# EAGLE design acceso (EAGLE 7.1.0)
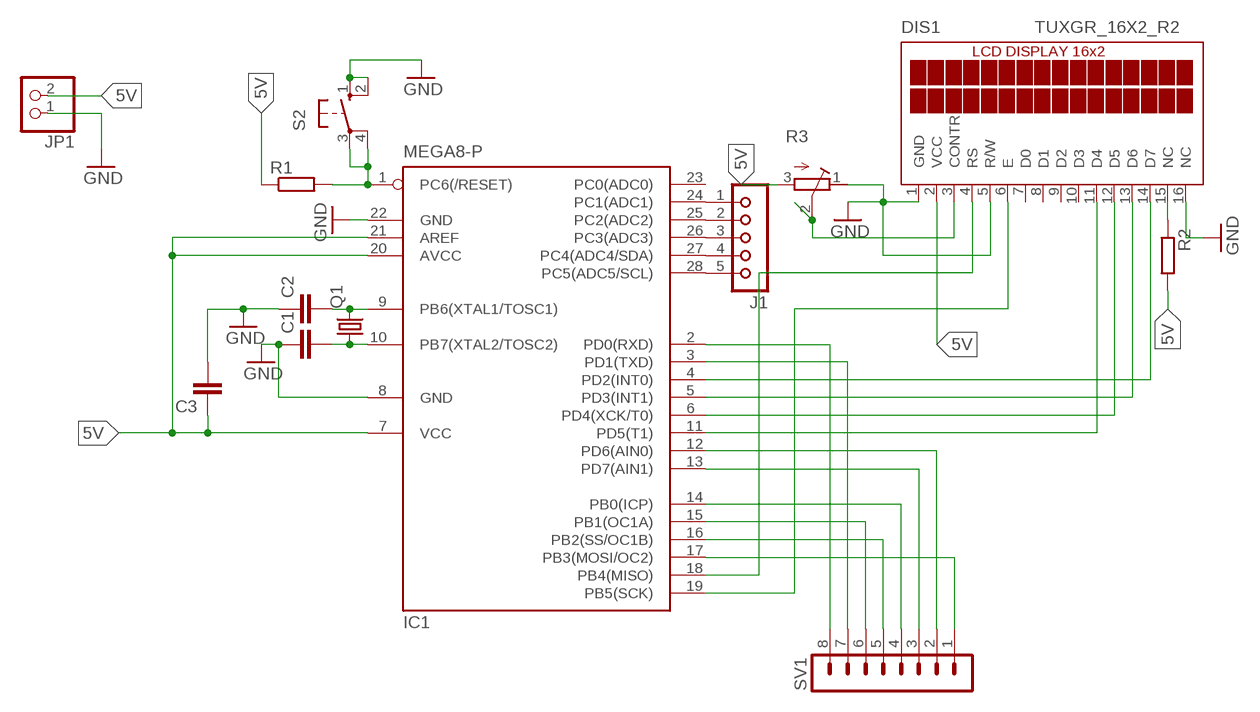
[diagram p0: schematic, sheet 1]

## Parts
C1  C2,5-3  [C2.5-3]
C2  C2,5-3  [C2.5-3]
C3  C2,5-3  [C2.5-3]
DIS1  TUXGR_16X2_R2  [TUXGR_16X2_R2]
IC1  MEGA8-P  [DIL28-3]
J1  JU05  [JU05]
JP1  PINHD-1X2  [1X02]
Q1  CRYSTALTC26V  [TC26V]
R1  R-EU_0204/5  [0204/5]
R2  R-EU_0204/5  [0204/5]
R3  R-TRIMM43P  [RTRIM43P]
S2  10-XX  [B3F-10XX]
SV1  MA08-1  [MA08-1]

## Nets
5V: C3.1 DIS1.2(VCC) IC1.7(VCC) IC1.20(AVCC) IC1.21(AREF) JP1.2 R1.1 R2.2 R3.3(A)
GND: C1.1 C2.1 C3.2 DIS1.1(GND) DIS1.5(R/W) DIS1.16(NC) IC1.8(GND) IC1.22(GND) JP1.1 R3.1(E) S2.1(S) S2.2(S1)
N$1: IC1.2(PD0(RXD)) SV1.8
N$2: IC1.3(PD1(TXD)) SV1.7
N$3: IC1.15(PB1(OC1A)) SV1.6
N$4: IC1.16(PB2(SS/OC1B)) SV1.5
N$5: IC1.14(PB0(ICP)) SV1.4
N$6: IC1.13(PD7(AIN1)) SV1.3
N$7: IC1.12(PD6(AIN0)) SV1.2
N$8: DIS1.4(RS) IC1.18(PB4(MISO))
N$9: DIS1.6(E) IC1.19(PB5(SCK))
N$10: DIS1.11(D4) IC1.11(PD5(T1))
N$11: DIS1.12(D5) IC1.6(PD4(XCK/T0))
N$12: DIS1.13(D6) IC1.5(PD3(INT1))
N$13: DIS1.15(NC) R2.1
N$14: C2.2 IC1.9(PB6(XTAL1/TOSC1)) Q1.2
N$15: C1.2 IC1.10(PB7(XTAL2/TOSC2)) Q1.1
N$16: IC1.1(PC6(/RESET)) R1.2 S2.3(P) S2.4(P1)
N$17: IC1.17(PB3(MOSI/OC2)) SV1.1
N$18: DIS1.14(D7) IC1.4(PD2(INT0))
N$19: IC1.24(PC1(ADC1)) J1.1
N$20: IC1.25(PC2(ADC2)) J1.2
N$21: DIS1.3(CONTR) R3.2(S)
N$22: IC1.26(PC3(ADC3)) J1.3
N$23: IC1.27(PC4(ADC4/SDA)) J1.4
N$24: IC1.28(PC5(ADC5/SCL)) J1.5
Unconnected: DIS1.7(D0) DIS1.8(D1) DIS1.9(D2) DIS1.10(D3) IC1.23(PC0(ADC0))

## Library data of the parts
C1-C3 = capacitor-wima:C: CAPACITOR naming: grid - package width
DIS1 = display-lcd:TUXGR_16X2_R2: Tuxgraphics LCD display 16x2 characters reflective, without background light Source: tuxgr_12x2_r2.pdf; OC_FARNELL: unknown; OC_NEWARK: unknown
IC1 = atmel:MEGA8-P: MICROCONTROLLER 8 Kbytes FLASH, 1 kbytes SRAM, 512 bytes EEPROM, USART, 4-channel 10 bit ADC, 2-channel 8 bit ADC Pin compatible with Atmega48, ATMega88, ATMega168 Source: avr.lbr; OC_FARNELL: unknown; OC_NEWARK: unknown
J1 = con-lsta:JU05: PIN HEADER; OC_FARNELL: unknown; OC_NEWARK: unknown
JP1 = pinhead:PINHD-1X2: PIN HEADER
Q1 = crystal:CRYSTAL: CRYSTAL; OC_FARNELL: unknown; OC_NEWARK: unknown
R1 R2 = rcl:R-EU_: RESISTOR, European symbol
R3 = rcl:R-TRIMM: Trimm resistor
S2 = switch-omron:10-XX: OMRON SWITCH; MPN: B3F-1000; OC_FARNELL: 176432; OC_NEWARK: 36M3542
SV1 = con-lstb:MA08-1: PIN HEADER; OC_FARNELL: unknown; OC_NEWARK: unknown

## Board
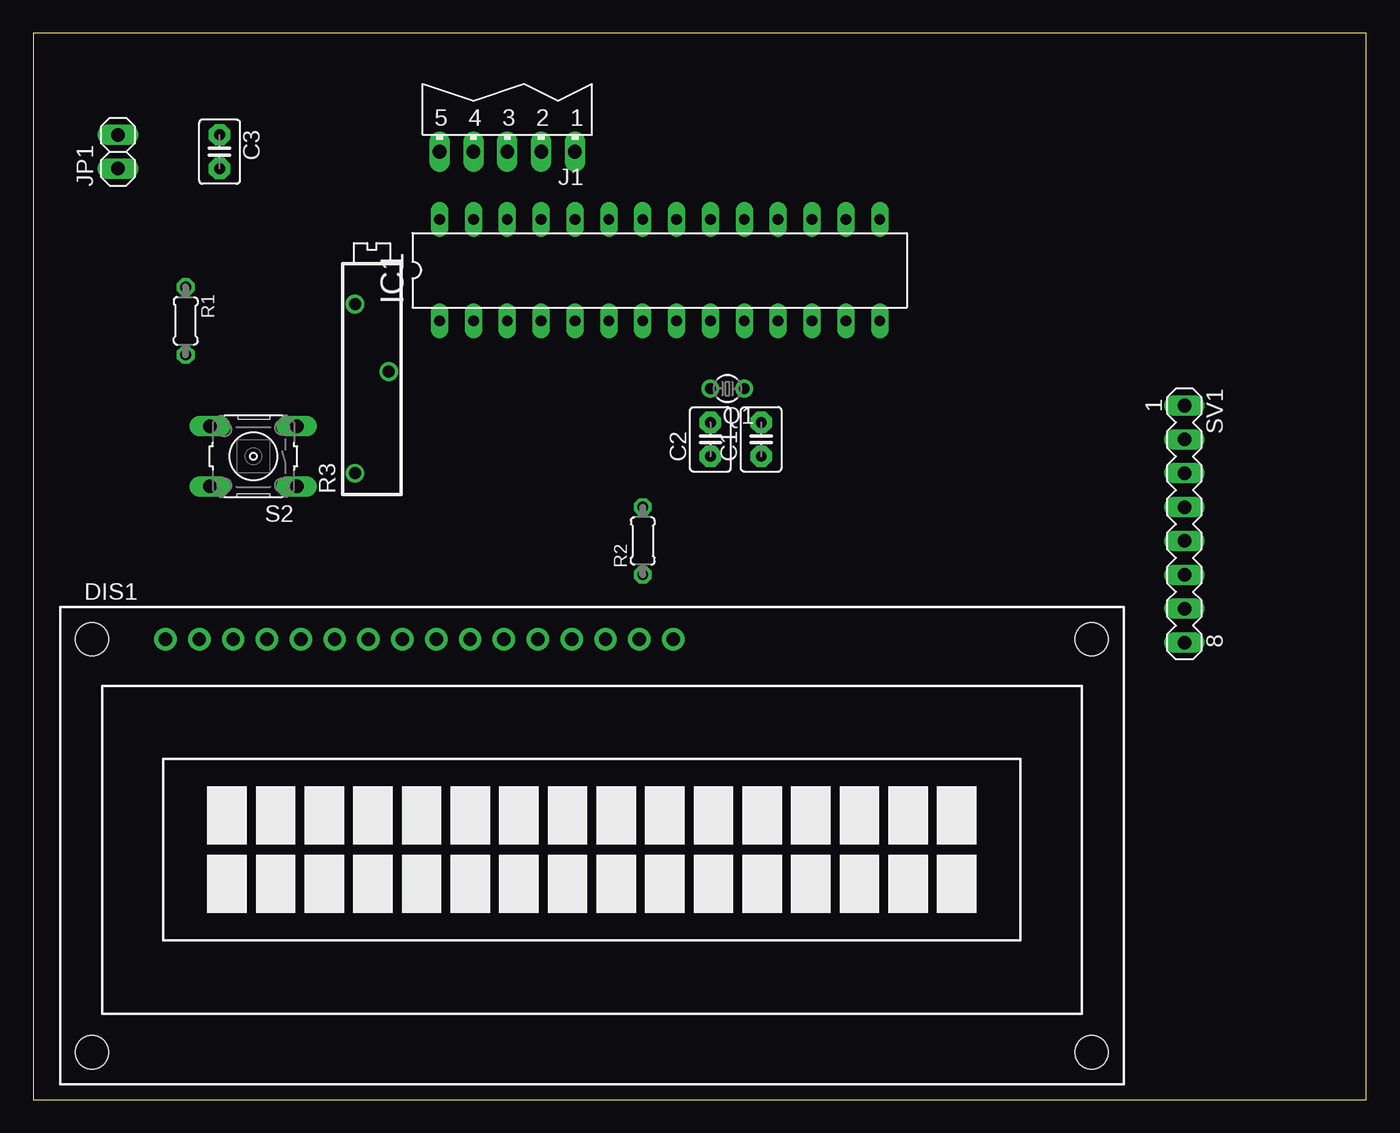
[diagram p1: board, top side]
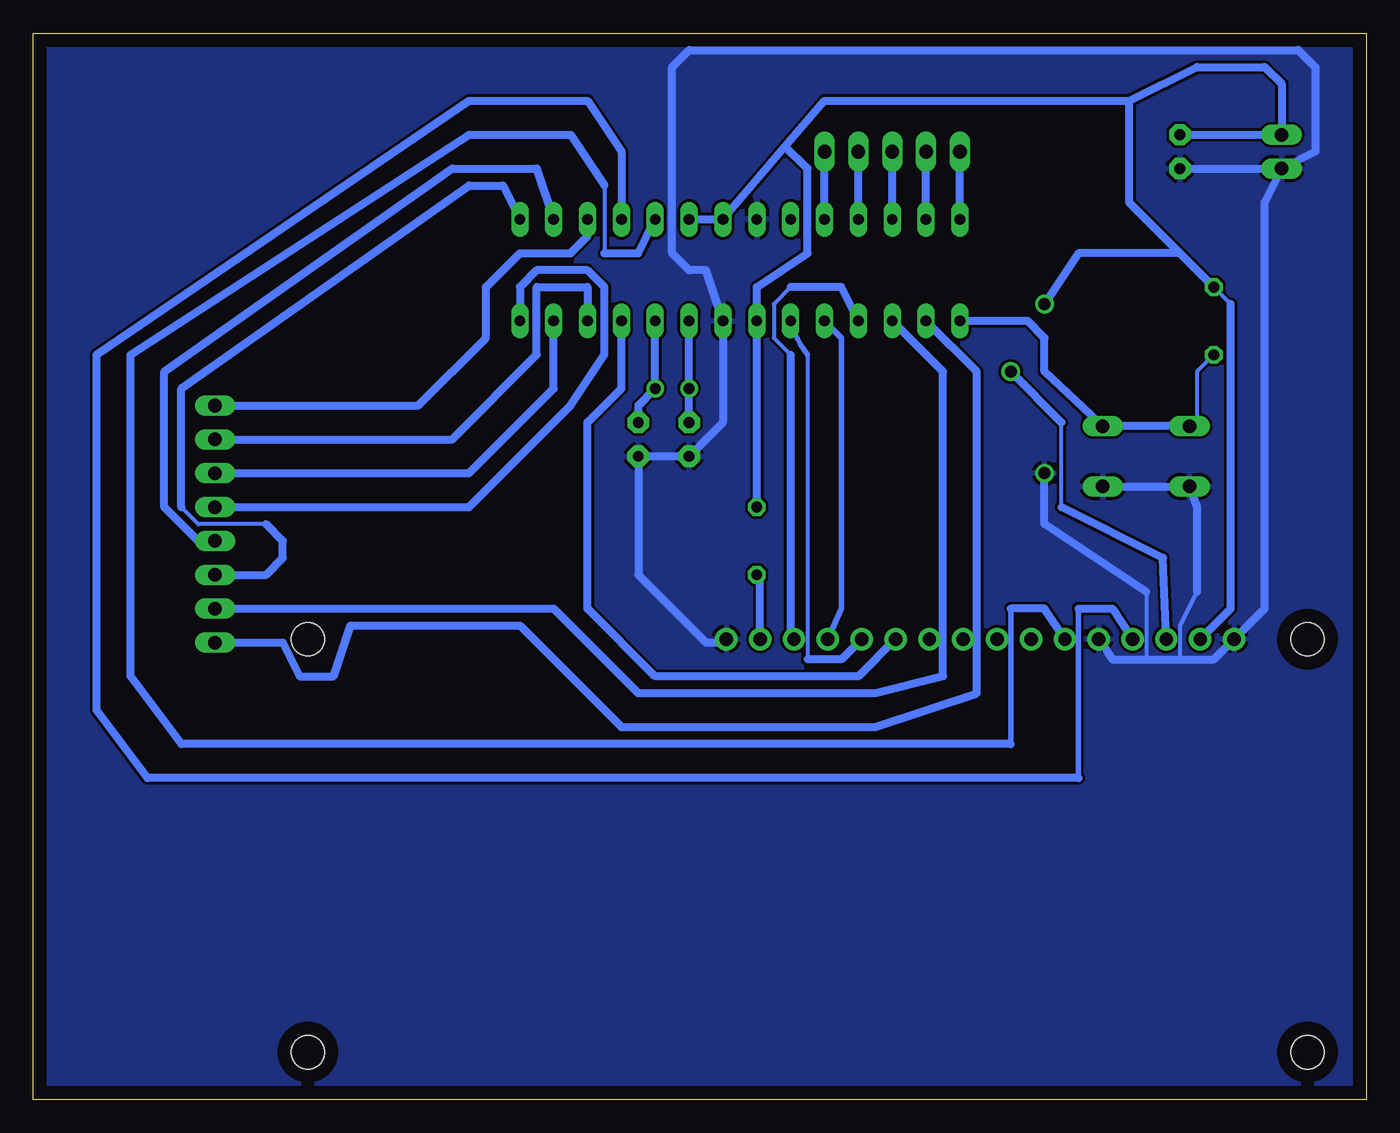
[diagram p2: board, bottom side, seen from below]

Size 100 x 80 mm. Coordinates in mm from the lower left corner, seen from the top.
Outline: 0,0 100,0 100,80 0,80 0,0
Copper layers (1*16): Top 0.035mm / dielectric 1.5mm / Bottom 0.035mm
Design rules "default": minimum track width 10mil, minimum drill 24mil, track to track 8mil, track to pad 8mil, pad to pad 8mil, via to via 8mil, smd to smd 8mil, copper to edge 40mil, drill to drill 8mil, minimum pad ring 10mil, minimum via ring 8mil, stop-mask expansion 4mil, vias tented up to drill 0mil, thermal gap 10mil

### Footprints (pad centres in the part's own frame; a part is rotated, then mirrored left to right if it is on the bottom)
C2.5-3 = drill 0.813 pad 1.6 octagon: 1 -1.27,0; 2 1.27,0
TUXGR_16X2_R2 = drill 1 pad 1.676: 1 -32,15.5; 2 -29.46,15.5; 3 -26.92,15.5; 4 -24.38,15.5; 5 -21.84,15.5; 6 -19.3,15.5; 7 -16.76,15.5; 8 -14.22,15.5; 9 -11.68,15.5; 10 -9.14,15.5; 11 -6.6,15.5; 12 -4.06,15.5; 13 -1.52,15.5; 14 1.02,15.5; 15 3.56,15.5; 16 6.1,15.5 | hole 2.5: -37.5,-15.5; 37.5,-15.5; -37.5,15.5; 37.5,15.5
DIL28-3 = drill 0.813 long: 1 -16.51,-3.81; 2 -13.97,-3.81; 3 -11.43,-3.81; 4 -8.89,-3.81; 5 -6.35,-3.81; 6 -3.81,-3.81; 7 -1.27,-3.81; 8 1.27,-3.81; 9 3.81,-3.81; 10 6.35,-3.81; 11 8.89,-3.81; 12 11.43,-3.81; 13 13.97,-3.81; 14 16.51,-3.81; 15 16.51,3.81; 16 13.97,3.81; 17 11.43,3.81; 18 8.89,3.81; 19 6.35,3.81; 20 3.81,3.81; 21 1.27,3.81; 22 -1.27,3.81; 23 -3.81,3.81; 24 -6.35,3.81; 25 -8.89,3.81; 26 -11.43,3.81; 27 -13.97,3.81; 28 -16.51,3.81
JU05 = drill 1.016 long: 1 -5.08,0; 2 -2.54,0; 3 0,0; 4 2.54,0; 5 5.08,0
1X02 = drill 1.016 long: 1 -1.27,0; 2 1.27,0
TC26V = drill 0.813: 1 -1.27,0; 2 1.27,0
0204/5 = drill 0.813 octagon: 1 -2.54,0; 2 2.54,0
RTRIM43P = drill 0.9: 1 -7.62,1.27; 2 0,-1.27; 3 5.08,1.27
B3F-10XX = drill 1.016 long: 1 -3.251,2.261; 2 3.251,2.261; 3 -3.251,-2.261; 4 3.251,-2.261
MA08-1 = drill 1.016 long: 1 -8.89,0; 2 -6.35,0; 3 -3.81,0; 4 -1.27,0; 5 1.27,0; 6 3.81,0; 7 6.35,0; 8 8.89,0

### Placement (x,y rotation side)
C1  54.61,49.53 90 top
C2  50.8,49.53 90 top
C3  13.97,71.12 270 top
DIS1  41.91,19.05 0 top
IC1  46.99,62.23 0 top
J1  35.56,71.12 180 top
JP1  6.35,71.12 90 top
Q1  52.07,53.34 180 top
R1  11.43,58.42 270 top
R2  45.72,41.91 90 top
R3  25.4,54.61 90 top
S2  16.51,48.26 180 top
SV1  86.36,43.18 270 top

### Tracks (layer width: path | path; a pad name or v marks a point on that pad's centre or on a via)
5V
  Bottom 0.305: 10.16,59.69 R1.1
  Bottom 0.61: IC1.20 IC1.21 43.6,71.48 | R2.2 IC1.7 45.72,60.96 41.91,63.5 41.91,69.85 43.6,71.48 | R1.1 13.97,63.5 | 13.97,63.5 21.59,63.5 R3.3 | C3.1 JP1.2 6.35,76.2 7.62,77.47 12.7,77.47 17.78,74.93 | 13.97,63.5 17.78,67.31 17.78,74.93 | DIS1.2 10.16,36.83 10.16,59.69 | 43.6,71.48 40.64,74.93 17.78,74.93
GND
  Bottom 0.305: 48.26,34.8 DIS1.16 48.27,34.29 | 13.97,33.02 13.97,35.56 12.7,38.1 | 16.51,38.1 16.51,33.02
  Bottom 0.61: 48.27,34.29 49.53,34.29 54.61,39.37 C1.1 C2.1 48.26,50.8 IC1.8 49.53,62.23 50.8,62.23 52.07,63.5 52.07,77.47 50.8,78.74 5.08,78.74 3.81,77.47 3.81,71.12 JP1.1 | S2.1 S2.2 12.7,44.45 12.7,38.1 | C3.2 JP1.1 | JP1.1 7.62,67.31 7.62,36.83 DIS1.1 11.43,33.02 13.97,33.02 16.51,33.02 19.05,33.02 DIS1.5 | 16.51,38.1 24.13,43.18 R3.1
  pour Bottom: -5.08,85.09 -5.08,-5.08 104.14,-5.08 104.14,85.09
N$1
  Bottom 0.61: IC1.2 29.21,54.61 29.21,30.48 36.83,27.94 55.88,27.94 63.5,35.56 76.2,35.56 77.47,31.75 80.01,31.75 81.28,34.29 SV1.8
N$2
  Bottom 0.61: SV1.7 60.96,36.83 54.61,30.48 36.83,30.48 31.75,31.75 31.75,54.61 IC1.3
N$3
  Bottom 0.305: 82.55,43.18 87.63,43.18 88.9,44.45
  Bottom 0.61: SV1.6 82.55,39.37 81.28,40.64 81.28,41.91 82.55,43.18 | 88.9,44.45 88.9,53.34 67.31,68.58 64.77,68.58 IC1.15
N$4
  Bottom 0.61: SV1.5 87.63,41.91 90.17,44.45 90.17,54.61 68.58,69.85 62.23,69.85 IC1.16
N$5
  Bottom 0.61: SV1.4 67.31,44.45 59.69,52.07 57.15,55.88 57.15,60.96 58.42,62.23 62.23,62.23 63.5,60.96 IC1.14
N$6
  Bottom 0.61: SV1.3 67.31,46.99 60.96,53.34 IC1.13
N$7
  Bottom 0.61: SV1.2 68.58,49.53 62.23,55.88 62.23,60.96 58.42,60.96 IC1.12
N$8
  Bottom 0.406: 21.59,24.13 21.59,36.83
  Bottom 0.61: 21.59,24.13 91.44,24.13 95.25,29.21 95.25,55.88 67.31,74.93 58.42,74.93 55.88,71.12 IC1.18 | 21.59,36.83 19.05,36.83 DIS1.4
N$9
  Bottom 0.305: 57.15,68.58 57.15,63.5
  Bottom 0.406: 26.67,36.83 26.67,26.67
  Bottom 0.61: 26.67,26.67 88.9,26.67 92.71,31.75 92.71,55.88 67.31,72.39 59.69,72.39 57.15,68.58 | 57.15,63.5 54.61,63.5 IC1.19 | DIS1.6 24.13,36.83 26.67,36.83
N$10
  Bottom 0.305: 38.1,31.76 38.1,31.75
  Bottom 0.61: DIS1.11 38.1,31.76 | 38.1,31.75 53.34,31.75 58.42,36.83 58.42,50.8 55.88,53.34 IC1.11
N$11
  Bottom 0.305: 41.91,55.88 41.91,33.02
  Bottom 0.406: 43.2,58.52 IC1.6 arc-25 41.91,55.88
  Bottom 0.61: DIS1.12 39.37,33.02 41.91,33.02
N$12
  Bottom 0.305: 40.39,58.17 IC1.5
  Bottom 0.406: DIS1.13 39.37,36.83 39.37,57.15 IC1.5
N$13
  Bottom 0.305: 45.47,39.12 arc-90 R2.1
  Bottom 0.61: DIS1.15 45.47,39.12
N$14
  Bottom 0.61: IC1.9 Q1.2 C2.2
N$15
  Bottom 0.61: IC1.10 Q1.1 54.61,52.07 C1.2
N$16
  Bottom 0.254: 11.43,55.78 R1.2
  Bottom 0.305: 11.43,55.78 11.53,55.78 12.7,54.61 12.7,51.08 S2.4 | 20.04,50.8 S2.3
  Bottom 0.61: S2.4 S2.3 | 20.04,50.8 24.13,54.61 24.13,57.15 25.4,58.42 IC1.1
N$17
  Bottom 0.61: SV1.1 71.12,52.07 66.04,57.15 66.04,60.96 63.5,63.5 59.69,63.5 58.42,64.77 IC1.17
N$18
  Bottom 0.305: 43.18,60.96 44.45,59.69 44.45,57.15 43.18,55.88
  Bottom 0.61: IC1.4 39.37,60.96 43.18,60.96 | 43.18,55.88 43.18,34.8 DIS1.14
N$19
  Bottom 0.61: IC1.24 J1.1
N$20
  Bottom 0.61: IC1.25 J1.2
N$21
  Bottom 0.305: 22.86,44.45 22.86,50.8
  Bottom 0.61: DIS1.3 15.24,40.64 22.86,44.45 | 22.86,50.8 R3.2
N$22
  Bottom 0.61: IC1.26 J1.3
N$23
  Bottom 0.61: IC1.27 J1.4
N$24
  Bottom 0.61: IC1.28 J1.5